# Altium schematic sheet Block Diagram.SchDoc
size A1; Author: İlker KESER; Revision: V1.0; SheetNumber: 1; SheetTotal: 9; Page: 1; Page Total: 9; Template: A1; Project Code: 02050838
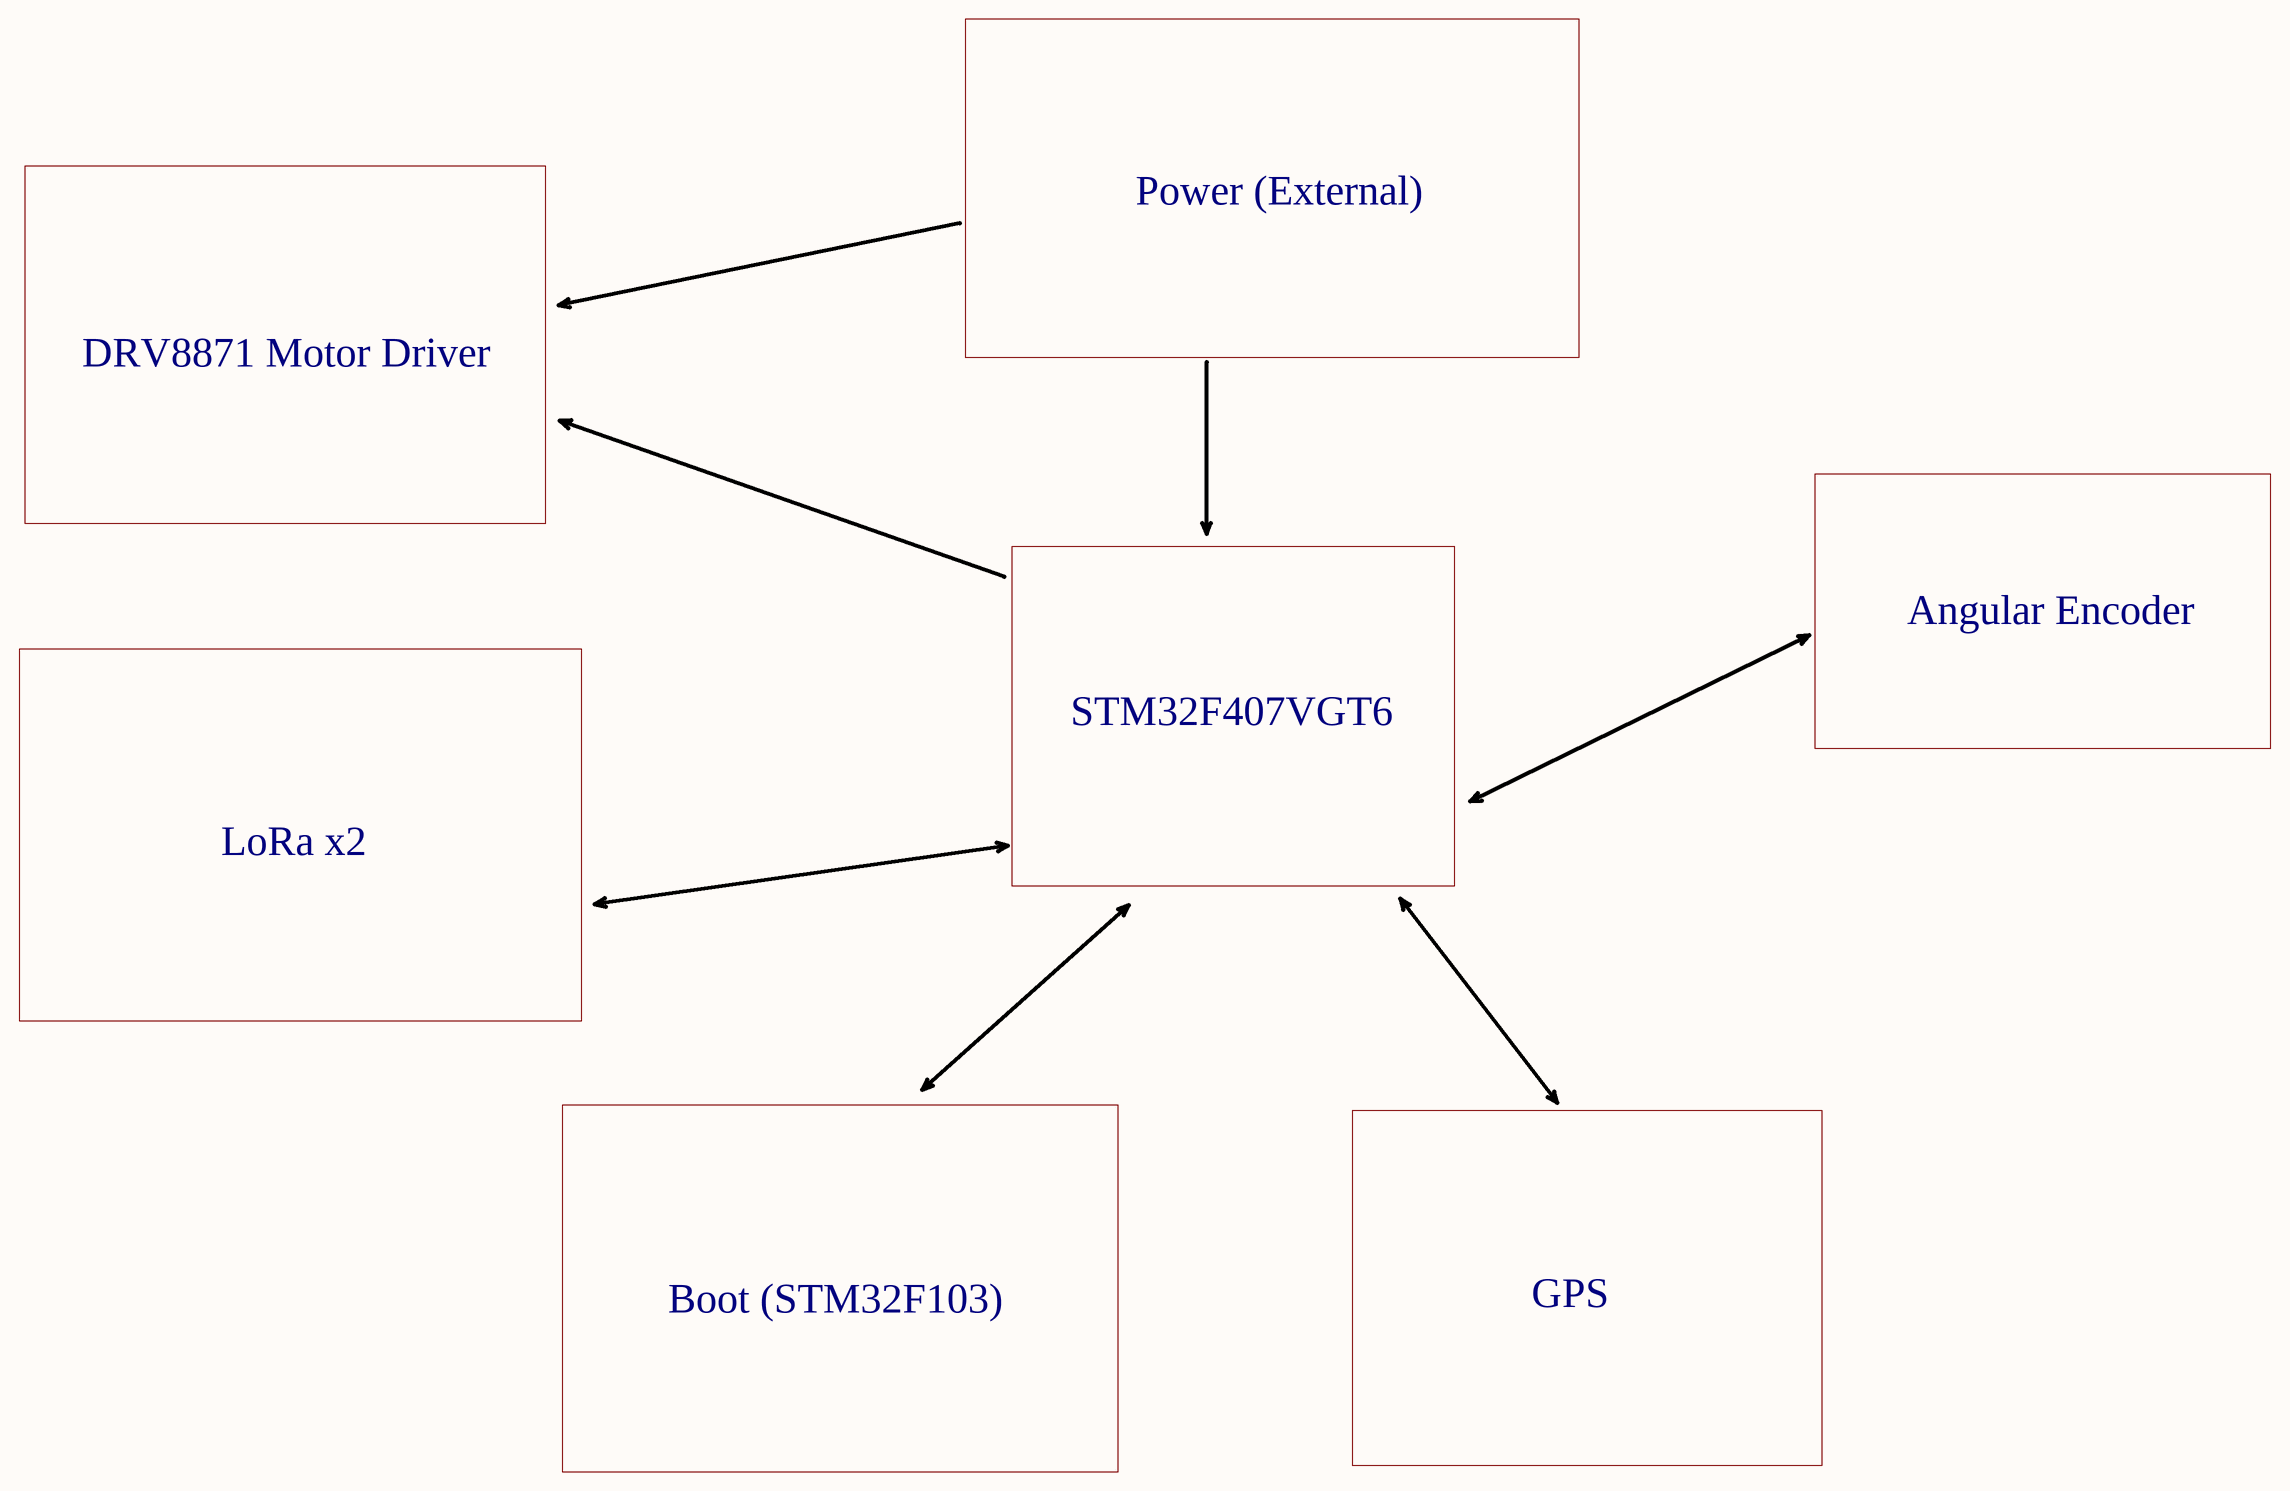
[diagram p0: Block Diagram.SchDoc]

## Notes on the sheet
- Power (External)
- DRV8871 Motor Driver
- Angular Encoder
- STM32F407VGT6
- LoRa x2
- Boot (STM32F103)
- GPS
- TITLE:
- DOCUMENT NAME:
- PROJECT CODE:
- TEMPLATE:
- AUTHOR:
- REVISION:
- Sheet:
- of